# Altium schematic sheet MainPCB.SchDoc
size A4; SheetNumber: 1; SheetTotal: 4
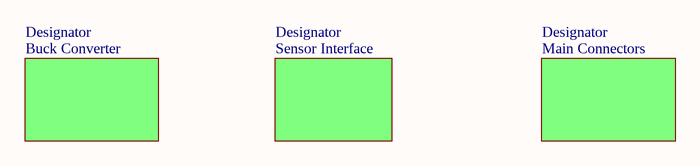
[diagram p0: MainPCB.SchDoc]

## Sub-sheets
Designator = Buck Converter: no entries
Designator = Sensor Interface: no entries
Designator = Main Connectors: no entries